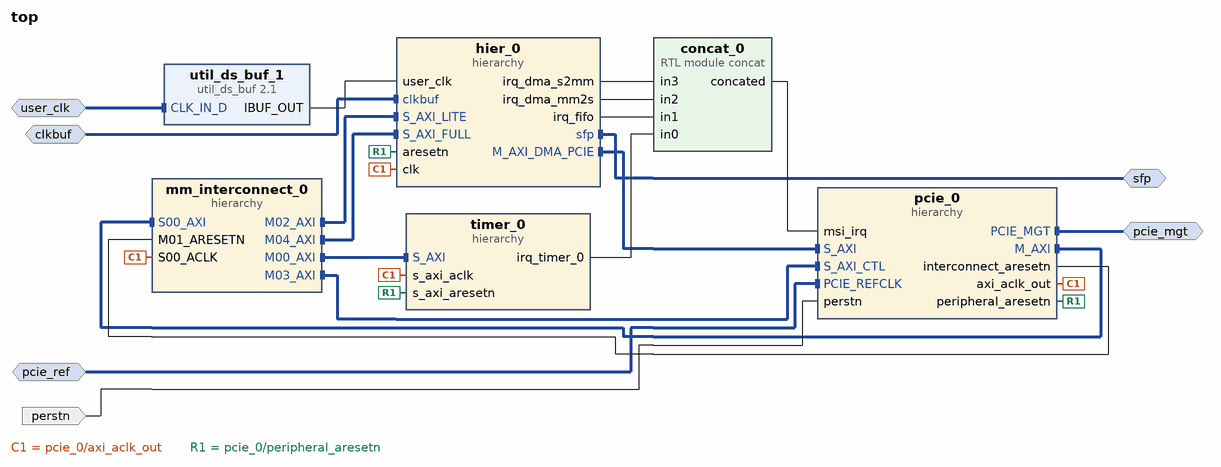
[diagram p0: block diagram of the top level]
# Vivado block design top, xc7vx485tffg1761-2, Vivado 2018.3
create_bd_design top

create_bd_intf_port -mode Slave -vlnv xilinx.com:interface:diff_clock_rtl:1.0 pcie_ref
create_bd_intf_port -mode Master -vlnv xilinx.com:interface:sfp_rtl:1.0 sfp
create_bd_intf_port -mode Slave -vlnv xilinx.com:interface:diff_clock_rtl:1.0 clkbuf
set_property -dict {CONFIG.FREQ_HZ 125000000} [get_bd_intf_ports clkbuf]
create_bd_intf_port -mode Master -vlnv xilinx.com:interface:pcie_7x_mgt_rtl:1.0 pcie_mgt
create_bd_intf_port -mode Slave -vlnv xilinx.com:interface:diff_clock_rtl:1.0 user_clk
set_property -dict {CONFIG.FREQ_HZ 156000000} [get_bd_intf_ports user_clk]
create_bd_port -dir I -type rst perstn

create_bd_cell -type hier timer_0
create_bd_cell -type hier hier_0
create_bd_cell -type hier mm_interconnect_0
create_bd_cell -type hier pcie_0
create_bd_cell -type module -reference concat concat_0
create_bd_cell -type ip -vlnv xilinx.com:ip:util_ds_buf:2.1 util_ds_buf_1

# ---- hierarchy /timer_0 ----
current_bd_instance /timer_0
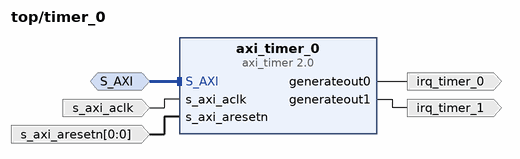
[diagram p1: block diagram inside /timer_0]
create_bd_intf_pin -mode Slave -vlnv xilinx.com:interface:aximm_rtl:1.0 S_AXI
create_bd_pin -dir I -type clk s_axi_aclk
create_bd_pin -dir I -from 0 -to 0 -type rst s_axi_aresetn
create_bd_pin -dir O irq_timer_0
create_bd_pin -dir O irq_timer_1

create_bd_cell -type ip -vlnv xilinx.com:ip:axi_timer:2.0 axi_timer_0

# ---- hierarchy /hier_0 ----
current_bd_instance /hier_0
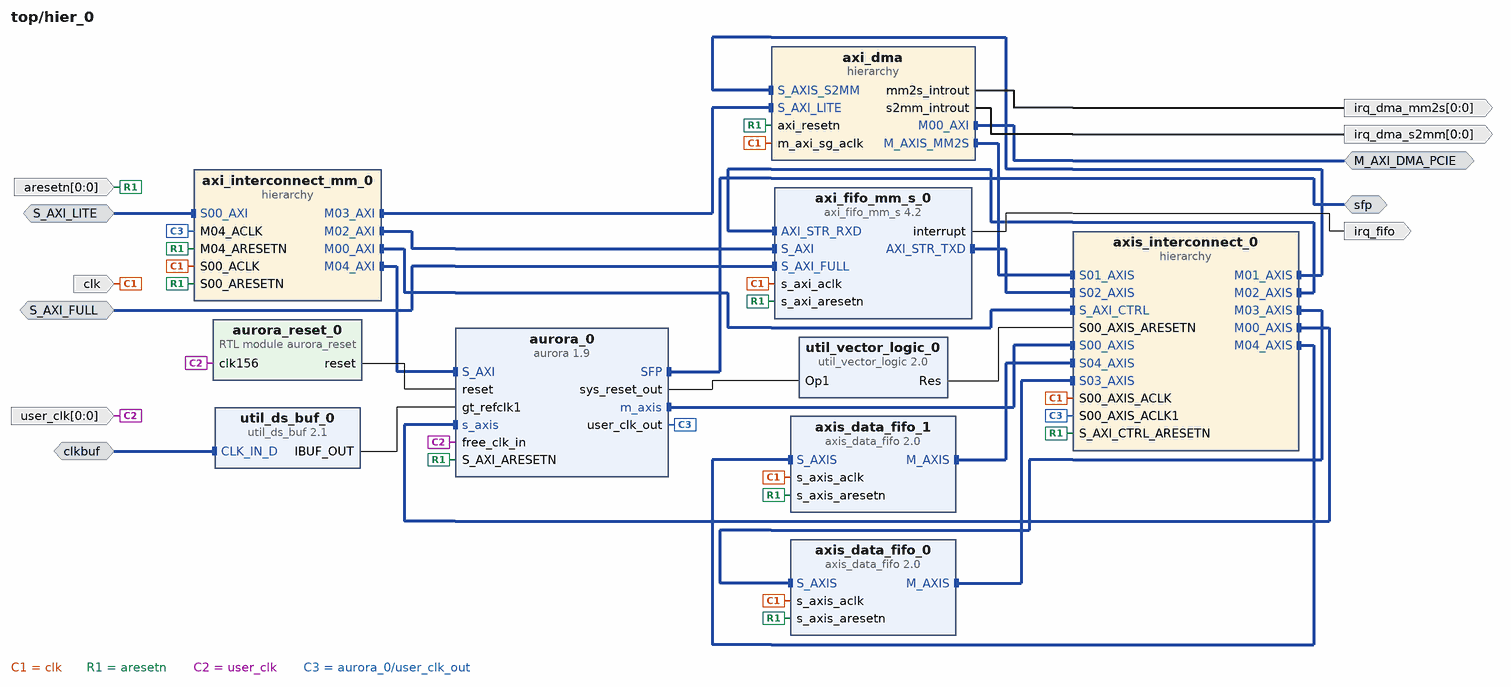
[diagram p2: block diagram inside /hier_0]
create_bd_intf_pin -mode Slave -vlnv xilinx.com:interface:aximm_rtl:1.0 S_AXI_LITE
create_bd_intf_pin -mode Master -vlnv xilinx.com:interface:sfp_rtl:1.0 sfp
create_bd_intf_pin -mode Slave -vlnv xilinx.com:interface:diff_clock_rtl:1.0 clkbuf
create_bd_intf_pin -mode Master -vlnv xilinx.com:interface:aximm_rtl:1.0 M_AXI_DMA_PCIE
create_bd_intf_pin -mode Slave -vlnv xilinx.com:interface:aximm_rtl:1.0 S_AXI_FULL
create_bd_pin -dir O -type intr irq_fifo
create_bd_pin -dir I -type clk clk
create_bd_pin -dir I -from 0 -to 0 -type rst aresetn
create_bd_pin -dir O -from 0 -to 0 -type intr irq_dma_mm2s
create_bd_pin -dir O -from 0 -to 0 -type intr irq_dma_s2mm
create_bd_pin -dir I -from 0 -to 0 user_clk

create_bd_cell -type hier axis_interconnect_0
create_bd_cell -type hier axi_interconnect_mm_0
create_bd_cell -type hier axi_dma
create_bd_cell -type module -reference aurora_reset aurora_reset_0
create_bd_cell -type ip -vlnv xilinx.com:ip:axi_fifo_mm_s:4.2 axi_fifo_mm_s_0
set_property -dict [list \
  CONFIG.C_AXIS_TUSER_WIDTH 4 \
  CONFIG.C_DATA_INTERFACE_TYPE 1 \
  CONFIG.C_RX_FIFO_DEPTH 4096 \
  CONFIG.C_RX_FIFO_PF_THRESHOLD 4090 \
  CONFIG.C_S_AXI4_DATA_WIDTH 32 \
  CONFIG.C_TX_FIFO_DEPTH 4096 \
  CONFIG.C_TX_FIFO_PF_THRESHOLD 4090 \
  CONFIG.C_USE_RX_CUT_THROUGH true \
  CONFIG.C_USE_TX_CTRL 0 \
  CONFIG.C_USE_TX_CUT_THROUGH 1 \
] [get_bd_cells axi_fifo_mm_s_0]
create_bd_cell -type ip -vlnv xilinx.com:ip:axis_data_fifo:2.0 axis_data_fifo_0
set_property -dict {CONFIG.FIFO_DEPTH 1024 CONFIG.HAS_RD_DATA_COUNT 1 CONFIG.HAS_WR_DATA_COUNT 1} [get_bd_cells axis_data_fifo_0]
create_bd_cell -type ip -vlnv xilinx.com:ip:axis_data_fifo:2.0 axis_data_fifo_1
set_property -dict {CONFIG.FIFO_DEPTH 1024 CONFIG.HAS_RD_DATA_COUNT 1 CONFIG.HAS_WR_DATA_COUNT 1} [get_bd_cells axis_data_fifo_1]
create_bd_cell -type ip -vlnv xilinx.com:ip:util_vector_logic:2.0 util_vector_logic_0
set_property -dict {CONFIG.C_OPERATION not CONFIG.C_SIZE 1} [get_bd_cells util_vector_logic_0]
create_bd_cell -type ip -vlnv xilinx.com:ip:util_ds_buf:2.1 util_ds_buf_0
set_property -dict [list \
  CONFIG.C_BUF_TYPE IBUFDSGTE \
  CONFIG.C_SIZE 1 \
  CONFIG.DIFF_CLK_IN_BOARD_INTERFACE Custom \
] [get_bd_cells util_ds_buf_0]
create_bd_cell -type ip -vlnv acs.eonerc.rwth-aachen.de:user:aurora:1.9 aurora_0

# ---- hierarchy /hier_0/axis_interconnect_0 ----
current_bd_instance /hier_0/axis_interconnect_0
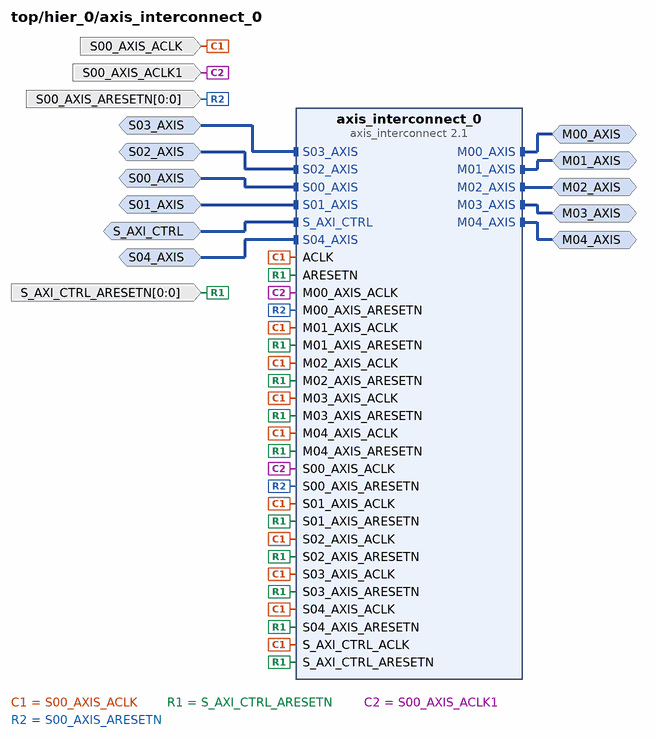
[diagram p3: block diagram inside /hier_0/axis_interconnect_0]
create_bd_intf_pin -mode Slave -vlnv xilinx.com:interface:axis_rtl:1.0 S00_AXIS
create_bd_intf_pin -mode Master -vlnv xilinx.com:interface:axis_rtl:1.0 M00_AXIS
create_bd_intf_pin -mode Master -vlnv xilinx.com:interface:axis_rtl:1.0 M01_AXIS
create_bd_intf_pin -mode Slave -vlnv xilinx.com:interface:axis_rtl:1.0 S01_AXIS
create_bd_intf_pin -mode Slave -vlnv xilinx.com:interface:axis_rtl:1.0 S02_AXIS
create_bd_intf_pin -mode Master -vlnv xilinx.com:interface:axis_rtl:1.0 M02_AXIS
create_bd_intf_pin -mode Slave -vlnv xilinx.com:interface:aximm_rtl:1.0 S_AXI_CTRL
create_bd_intf_pin -mode Master -vlnv xilinx.com:interface:axis_rtl:1.0 M03_AXIS
create_bd_intf_pin -mode Slave -vlnv xilinx.com:interface:axis_rtl:1.0 S03_AXIS
create_bd_intf_pin -mode Master -vlnv xilinx.com:interface:axis_rtl:1.0 M04_AXIS
create_bd_intf_pin -mode Slave -vlnv xilinx.com:interface:axis_rtl:1.0 S04_AXIS
create_bd_pin -dir I -type clk S00_AXIS_ACLK
create_bd_pin -dir I -from 0 -to 0 -type rst S_AXI_CTRL_ARESETN
create_bd_pin -dir I -type clk S00_AXIS_ACLK1
create_bd_pin -dir I -from 0 -to 0 -type rst S00_AXIS_ARESETN

create_bd_cell -type ip -vlnv xilinx.com:ip:axis_interconnect:2.1 axis_interconnect_0
set_property -dict [list \
  CONFIG.ENABLE_ADVANCED_OPTIONS 1 \
  CONFIG.NUM_MI 5 \
  CONFIG.NUM_SI 5 \
  CONFIG.ROUTING_MODE 1 \
] [get_bd_cells axis_interconnect_0]

# ---- hierarchy /hier_0/axi_interconnect_mm_0 ----
current_bd_instance /hier_0/axi_interconnect_mm_0
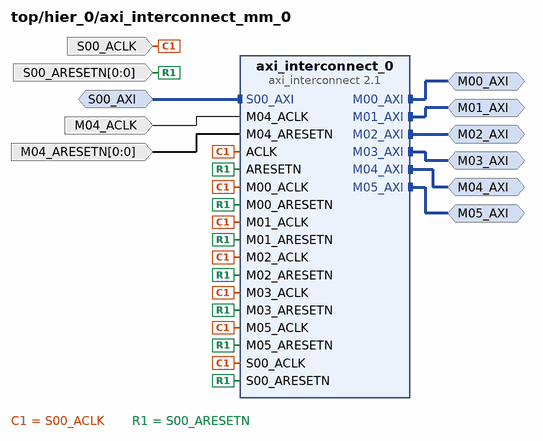
[diagram p4: block diagram inside /hier_0/axi_interconnect_mm_0]
create_bd_intf_pin -mode Slave -vlnv xilinx.com:interface:aximm_rtl:1.0 S00_AXI
create_bd_intf_pin -mode Master -vlnv xilinx.com:interface:aximm_rtl:1.0 M00_AXI
create_bd_intf_pin -mode Master -vlnv xilinx.com:interface:aximm_rtl:1.0 M01_AXI
create_bd_intf_pin -mode Master -vlnv xilinx.com:interface:aximm_rtl:1.0 M02_AXI
create_bd_intf_pin -mode Master -vlnv xilinx.com:interface:aximm_rtl:1.0 M03_AXI
create_bd_intf_pin -mode Master -vlnv xilinx.com:interface:aximm_rtl:1.0 M04_AXI
create_bd_intf_pin -mode Master -vlnv xilinx.com:interface:aximm_rtl:1.0 M05_AXI
create_bd_pin -dir I -type clk S00_ACLK
create_bd_pin -dir I -from 0 -to 0 -type rst S00_ARESETN
create_bd_pin -dir I -type clk M04_ACLK
create_bd_pin -dir I -from 0 -to 0 -type rst M04_ARESETN

create_bd_cell -type ip -vlnv xilinx.com:ip:axi_interconnect:2.1 axi_interconnect_0
set_property -dict {CONFIG.NUM_MI 6 CONFIG.SYNCHRONIZATION_STAGES 2} [get_bd_cells axi_interconnect_0]

# ---- hierarchy /hier_0/axi_dma ----
current_bd_instance /hier_0/axi_dma
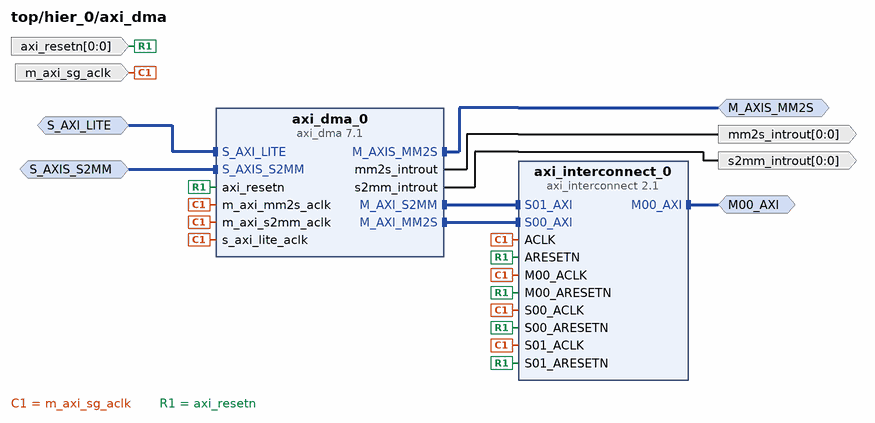
[diagram p5: block diagram inside /hier_0/axi_dma]
create_bd_intf_pin -mode Slave -vlnv xilinx.com:interface:aximm_rtl:1.0 S_AXI_LITE
create_bd_intf_pin -mode Master -vlnv xilinx.com:interface:axis_rtl:1.0 M_AXIS_MM2S
create_bd_intf_pin -mode Slave -vlnv xilinx.com:interface:axis_rtl:1.0 S_AXIS_S2MM
create_bd_intf_pin -mode Master -vlnv xilinx.com:interface:aximm_rtl:1.0 M00_AXI
create_bd_pin -dir I -type clk m_axi_sg_aclk
create_bd_pin -dir I -from 0 -to 0 -type rst axi_resetn
create_bd_pin -dir O -from 0 -to 0 -type intr mm2s_introut
create_bd_pin -dir O -from 0 -to 0 -type intr s2mm_introut

create_bd_cell -type ip -vlnv xilinx.com:ip:axi_dma:7.1 axi_dma_0
set_property -dict [list \
  CONFIG.c_include_mm2s_dre 1 \
  CONFIG.c_include_s2mm_dre 1 \
  CONFIG.c_include_sg 0 \
  CONFIG.c_m_axi_mm2s_data_width 128 \
  CONFIG.c_m_axi_s2mm_data_width 128 \
  CONFIG.c_mm2s_burst_size 64 \
  CONFIG.c_s2mm_burst_size 64 \
] [get_bd_cells axi_dma_0]
create_bd_cell -type ip -vlnv xilinx.com:ip:axi_interconnect:2.1 axi_interconnect_0
set_property -dict {CONFIG.NUM_MI 1 CONFIG.NUM_SI 2 CONFIG.SYNCHRONIZATION_STAGES 2} [get_bd_cells axi_interconnect_0]

# ---- hierarchy /mm_interconnect_0 ----
current_bd_instance /mm_interconnect_0
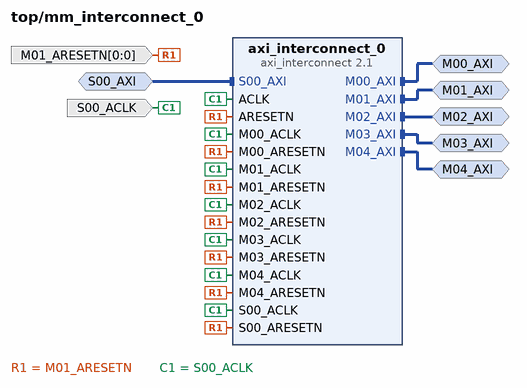
[diagram p6: block diagram inside /mm_interconnect_0]
create_bd_intf_pin -mode Master -vlnv xilinx.com:interface:aximm_rtl:1.0 M00_AXI
create_bd_intf_pin -mode Master -vlnv xilinx.com:interface:aximm_rtl:1.0 M01_AXI
create_bd_intf_pin -mode Master -vlnv xilinx.com:interface:aximm_rtl:1.0 M02_AXI
create_bd_intf_pin -mode Slave -vlnv xilinx.com:interface:aximm_rtl:1.0 S00_AXI
create_bd_intf_pin -mode Master -vlnv xilinx.com:interface:aximm_rtl:1.0 M03_AXI
create_bd_intf_pin -mode Master -vlnv xilinx.com:interface:aximm_rtl:1.0 M04_AXI
create_bd_pin -dir I -type clk S00_ACLK
create_bd_pin -dir I -from 0 -to 0 -type rst M01_ARESETN

create_bd_cell -type ip -vlnv xilinx.com:ip:axi_interconnect:2.1 axi_interconnect_0
set_property -dict [list \
  CONFIG.ENABLE_ADVANCED_OPTIONS 1 \
  CONFIG.NUM_MI 5 \
  CONFIG.NUM_SI 1 \
  CONFIG.SYNCHRONIZATION_STAGES 2 \
] [get_bd_cells axi_interconnect_0]

# ---- hierarchy /pcie_0 ----
current_bd_instance /pcie_0
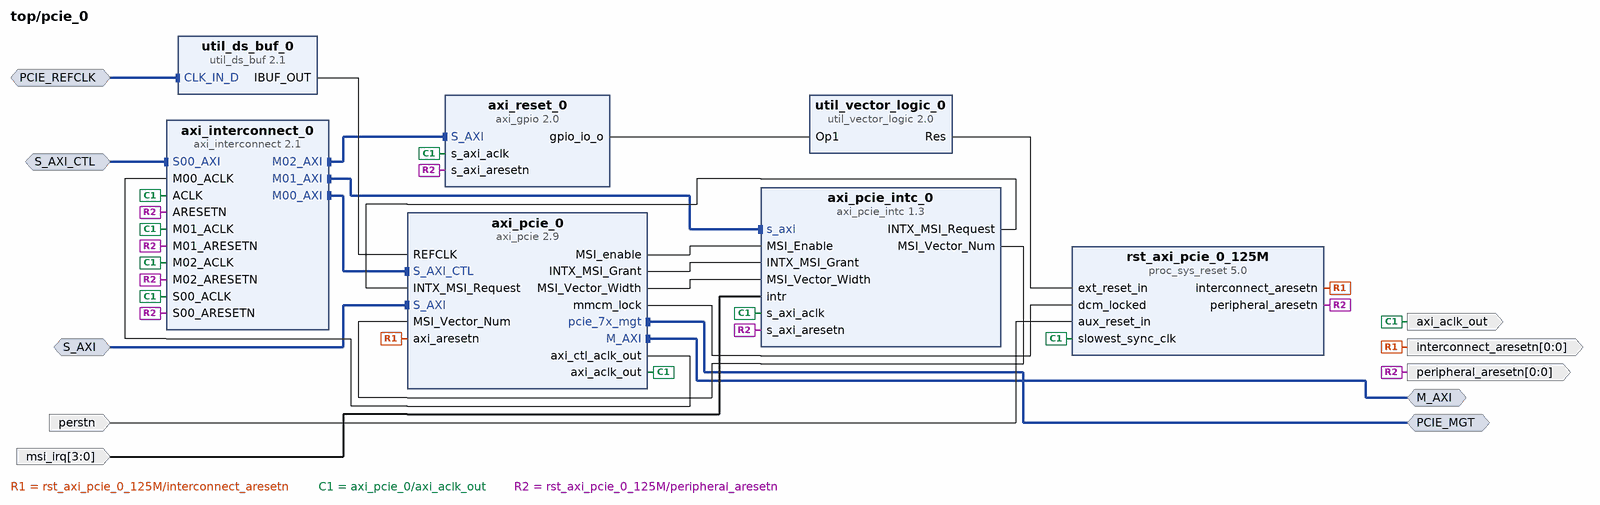
[diagram p7: block diagram inside /pcie_0]
create_bd_intf_pin -mode Master -vlnv xilinx.com:interface:aximm_rtl:1.0 M_AXI
create_bd_intf_pin -mode Master -vlnv xilinx.com:interface:pcie_7x_mgt_rtl:1.0 PCIE_MGT
create_bd_intf_pin -mode Slave -vlnv xilinx.com:interface:diff_clock_rtl:1.0 PCIE_REFCLK
create_bd_intf_pin -mode Slave -vlnv xilinx.com:interface:aximm_rtl:1.0 S_AXI
create_bd_intf_pin -mode Slave -vlnv xilinx.com:interface:aximm_rtl:1.0 S_AXI_CTL
create_bd_pin -dir O -type clk axi_aclk_out
create_bd_pin -dir O -from 0 -to 0 -type rst interconnect_aresetn
create_bd_pin -dir I -from 3 -to 0 msi_irq
create_bd_pin -dir O -from 0 -to 0 -type rst peripheral_aresetn
create_bd_pin -dir I -type rst perstn

create_bd_cell -type ip -vlnv xilinx.com:ip:axi_interconnect:2.1 axi_interconnect_0
set_property -dict {CONFIG.NUM_MI 3 CONFIG.SYNCHRONIZATION_STAGES 2} [get_bd_cells axi_interconnect_0]
create_bd_cell -type ip -vlnv xilinx.com:ip:axi_pcie:2.9 axi_pcie_0
set_property -dict [list \
  CONFIG.AXIBAR2PCIEBAR_0 0x00000000 \
  CONFIG.AXIBAR_AS_0 false \
  CONFIG.AXIBAR_NUM 1 \
  CONFIG.BAR0_SCALE Megabytes \
  CONFIG.BAR0_SIZE 4 \
  CONFIG.BAR1_ENABLED false \
  CONFIG.BAR1_SCALE N/A \
  CONFIG.BAR1_SIZE 8 \
  CONFIG.BAR1_TYPE N/A \
  CONFIG.BASE_CLASS_MENU Memory_controller \
  CONFIG.CLASS_CODE 0x050000 \
  CONFIG.COMP_TIMEOUT 50ms \
  CONFIG.DEVICE_ID 0x7022 \
  CONFIG.ENABLE_CLASS_CODE false \
  CONFIG.HIGHADDR 0x10000FFF \
  CONFIG.INTERRUPT_PIN false \
  CONFIG.MAX_LINK_SPEED 5.0_GT/s \
  CONFIG.M_AXI_DATA_WIDTH 128 \
  CONFIG.NO_OF_LANES X4 \
  CONFIG.NUM_MSI_REQ 4 \
  CONFIG.PCIEBAR2AXIBAR_1 0xFFFFFFFF \
  CONFIG.PCIE_BLK_LOCN X1Y0 \
  CONFIG.SUB_CLASS_INTERFACE_MENU RAM \
  CONFIG.S_AXI_DATA_WIDTH 128 \
  CONFIG.S_AXI_SUPPORTS_NARROW_BURST true \
  CONFIG.XLNX_REF_BOARD VC707 \
  CONFIG.en_transceiver_status_ports false \
] [get_bd_cells axi_pcie_0]
create_bd_cell -type ip -vlnv xilinx.com:ip:util_vector_logic:2.0 util_vector_logic_0
set_property -dict {CONFIG.C_OPERATION not CONFIG.C_SIZE 1} [get_bd_cells util_vector_logic_0]
create_bd_cell -type ip -vlnv xilinx.com:ip:axi_gpio:2.0 axi_reset_0
set_property -dict [list \
  CONFIG.C_ALL_OUTPUTS 1 \
  CONFIG.C_DOUT_DEFAULT 0x00000000 \
  CONFIG.C_GPIO_WIDTH 1 \
  CONFIG.C_INTERRUPT_PRESENT 0 \
] [get_bd_cells axi_reset_0]
create_bd_cell -type ip -vlnv xilinx.com:ip:proc_sys_reset:5.0 rst_axi_pcie_0_125M
set_property -dict [list \
  CONFIG.C_AUX_RESET_HIGH 0 \
  CONFIG.C_AUX_RST_WIDTH 1 \
  CONFIG.C_EXT_RST_WIDTH 8 \
  CONFIG.RESET_BOARD_INTERFACE Custom \
  CONFIG.USE_BOARD_FLOW true \
] [get_bd_cells rst_axi_pcie_0_125M]
create_bd_cell -type ip -vlnv xilinx.com:ip:util_ds_buf:2.1 util_ds_buf_0
set_property -dict {CONFIG.C_BUF_TYPE IBUFDSGTE} [get_bd_cells util_ds_buf_0]
create_bd_cell -type ip -vlnv acs.eonerc.rwth-aachen.de:user:axi_pcie_intc:1.3 axi_pcie_intc_0

# ---- connections ----

current_bd_instance /timer_0
connect_bd_intf_net [get_bd_intf_pins S_AXI] [get_bd_intf_pins axi_timer_0/S_AXI]
connect_bd_net -net axi_pcie_0_axi_aclk_out1 [get_bd_pins s_axi_aclk] [get_bd_pins axi_timer_0/s_axi_aclk]
connect_bd_net -net rst_axi_pcie_0_125M_peripheral_aresetn [get_bd_pins s_axi_aresetn] [get_bd_pins axi_timer_0/s_axi_aresetn]
connect_bd_net [get_bd_pins axi_timer_0/generateout1] [get_bd_pins irq_timer_1]
connect_bd_net [get_bd_pins axi_timer_0/generateout0] [get_bd_pins irq_timer_0]

current_bd_instance /hier_0
connect_bd_intf_net [get_bd_intf_pins sfp] [get_bd_intf_pins aurora_0/SFP]
connect_bd_intf_net [get_bd_intf_pins axis_interconnect_0/S_AXI_CTRL] [get_bd_intf_pins axi_interconnect_mm_0/M00_AXI]
connect_bd_intf_net [get_bd_intf_pins axi_interconnect_mm_0/M02_AXI] [get_bd_intf_pins axi_fifo_mm_s_0/S_AXI]
connect_bd_intf_net [get_bd_intf_pins axis_interconnect_0/S01_AXIS] [get_bd_intf_pins axi_dma/M_AXIS_MM2S]
connect_bd_intf_net [get_bd_intf_pins axis_interconnect_0/M04_AXIS] [get_bd_intf_pins axis_data_fifo_1/S_AXIS]
connect_bd_intf_net [get_bd_intf_pins axis_interconnect_0/M01_AXIS] [get_bd_intf_pins axi_dma/S_AXIS_S2MM]
connect_bd_intf_net [get_bd_intf_pins axis_data_fifo_0/M_AXIS] [get_bd_intf_pins axis_interconnect_0/S03_AXIS]
connect_bd_intf_net [get_bd_intf_pins aurora_0/S_AXI] [get_bd_intf_pins axi_interconnect_mm_0/M04_AXI]
connect_bd_intf_net [get_bd_intf_pins axis_data_fifo_1/M_AXIS] [get_bd_intf_pins axis_interconnect_0/S04_AXIS]
connect_bd_intf_net [get_bd_intf_pins axis_interconnect_0/M02_AXIS] [get_bd_intf_pins axi_fifo_mm_s_0/AXI_STR_RXD]
connect_bd_intf_net [get_bd_intf_pins axis_data_fifo_0/S_AXIS] [get_bd_intf_pins axis_interconnect_0/M03_AXIS]
connect_bd_intf_net [get_bd_intf_pins aurora_0/m_axis] [get_bd_intf_pins axis_interconnect_0/S00_AXIS]
connect_bd_intf_net [get_bd_intf_pins S_AXI_LITE] [get_bd_intf_pins axi_interconnect_mm_0/S00_AXI]
connect_bd_intf_net [get_bd_intf_pins axis_interconnect_0/S02_AXIS] [get_bd_intf_pins axi_fifo_mm_s_0/AXI_STR_TXD]
connect_bd_intf_net [get_bd_intf_pins clkbuf] [get_bd_intf_pins util_ds_buf_0/CLK_IN_D]
connect_bd_intf_net [get_bd_intf_pins aurora_0/s_axis] [get_bd_intf_pins axis_interconnect_0/M00_AXIS]
connect_bd_intf_net [get_bd_intf_pins S_AXI_FULL] [get_bd_intf_pins axi_fifo_mm_s_0/S_AXI_FULL]
connect_bd_intf_net [get_bd_intf_pins axi_dma/S_AXI_LITE] [get_bd_intf_pins axi_interconnect_mm_0/M03_AXI]
connect_bd_intf_net [get_bd_intf_pins M_AXI_DMA_PCIE] [get_bd_intf_pins axi_dma/M00_AXI]
connect_bd_net -net xsg_pio_interrupt [get_bd_pins axi_fifo_mm_s_0/interrupt] [get_bd_pins irq_fifo]
connect_bd_net -net s_axi_aclk_1 [get_bd_pins clk] \
  [get_bd_pins axis_interconnect_0/S00_AXIS_ACLK] [get_bd_pins axi_interconnect_mm_0/S00_ACLK] \
  [get_bd_pins axi_dma/m_axi_sg_aclk] [get_bd_pins axi_fifo_mm_s_0/s_axi_aclk] [get_bd_pins axis_data_fifo_0/s_axis_aclk] \
  [get_bd_pins axis_data_fifo_1/s_axis_aclk]
connect_bd_net -net axi_dma_0_mm2s_introut [get_bd_pins axi_dma/mm2s_introut] [get_bd_pins irq_dma_mm2s]
connect_bd_net -net axi_dma_0_s2mm_introut [get_bd_pins axi_dma/s2mm_introut] [get_bd_pins irq_dma_s2mm]
connect_bd_net -net pcie_0_peripheral_aresetn [get_bd_pins aresetn] \
  [get_bd_pins axis_interconnect_0/S_AXI_CTRL_ARESETN] [get_bd_pins axi_interconnect_mm_0/S00_ARESETN] \
  [get_bd_pins axi_dma/axi_resetn] [get_bd_pins axi_interconnect_mm_0/M04_ARESETN] \
  [get_bd_pins axi_fifo_mm_s_0/s_axi_aresetn] [get_bd_pins axis_data_fifo_0/s_axis_aresetn] \
  [get_bd_pins axis_data_fifo_1/s_axis_aresetn] [get_bd_pins aurora_0/S_AXI_ARESETN]
connect_bd_net [get_bd_pins aurora_0/sys_reset_out] [get_bd_pins util_vector_logic_0/Op1]
connect_bd_net [get_bd_pins util_ds_buf_0/IBUF_OUT] [get_bd_pins aurora_0/gt_refclk1]
connect_bd_net [get_bd_pins user_clk] [get_bd_pins aurora_reset_0/clk156] [get_bd_pins aurora_0/free_clk_in]
connect_bd_net -net S00_AXIS_ACLK1_1 [get_bd_pins aurora_0/user_clk_out] \
  [get_bd_pins axis_interconnect_0/S00_AXIS_ACLK1] [get_bd_pins axi_interconnect_mm_0/M04_ACLK]
connect_bd_net -net S00_AXIS_ARESETN_1 [get_bd_pins util_vector_logic_0/Res] [get_bd_pins axis_interconnect_0/S00_AXIS_ARESETN]
connect_bd_net [get_bd_pins aurora_reset_0/reset] [get_bd_pins aurora_0/reset]

current_bd_instance /hier_0/axis_interconnect_0
connect_bd_intf_net [get_bd_intf_pins M04_AXIS] [get_bd_intf_pins axis_interconnect_0/M04_AXIS]
connect_bd_intf_net [get_bd_intf_pins S03_AXIS] [get_bd_intf_pins axis_interconnect_0/S03_AXIS]
connect_bd_intf_net [get_bd_intf_pins S02_AXIS] [get_bd_intf_pins axis_interconnect_0/S02_AXIS]
connect_bd_intf_net [get_bd_intf_pins M03_AXIS] [get_bd_intf_pins axis_interconnect_0/M03_AXIS]
connect_bd_intf_net [get_bd_intf_pins S00_AXIS] [get_bd_intf_pins axis_interconnect_0/S00_AXIS]
connect_bd_intf_net [get_bd_intf_pins M02_AXIS] [get_bd_intf_pins axis_interconnect_0/M02_AXIS]
connect_bd_intf_net [get_bd_intf_pins S01_AXIS] [get_bd_intf_pins axis_interconnect_0/S01_AXIS]
connect_bd_intf_net [get_bd_intf_pins S_AXI_CTRL] [get_bd_intf_pins axis_interconnect_0/S_AXI_CTRL]
connect_bd_intf_net [get_bd_intf_pins M01_AXIS] [get_bd_intf_pins axis_interconnect_0/M01_AXIS]
connect_bd_intf_net [get_bd_intf_pins M00_AXIS] [get_bd_intf_pins axis_interconnect_0/M00_AXIS]
connect_bd_intf_net [get_bd_intf_pins S04_AXIS] [get_bd_intf_pins axis_interconnect_0/S04_AXIS]
connect_bd_net -net s_axi_aclk_2 [get_bd_pins S00_AXIS_ACLK] \
  [get_bd_pins axis_interconnect_0/ACLK] [get_bd_pins axis_interconnect_0/S01_AXIS_ACLK] \
  [get_bd_pins axis_interconnect_0/S02_AXIS_ACLK] [get_bd_pins axis_interconnect_0/S03_AXIS_ACLK] \
  [get_bd_pins axis_interconnect_0/S04_AXIS_ACLK] [get_bd_pins axis_interconnect_0/M01_AXIS_ACLK] \
  [get_bd_pins axis_interconnect_0/M02_AXIS_ACLK] [get_bd_pins axis_interconnect_0/M03_AXIS_ACLK] \
  [get_bd_pins axis_interconnect_0/M04_AXIS_ACLK] [get_bd_pins axis_interconnect_0/S_AXI_CTRL_ACLK]
connect_bd_net -net s_axi_aresetn_1 [get_bd_pins S_AXI_CTRL_ARESETN] \
  [get_bd_pins axis_interconnect_0/ARESETN] [get_bd_pins axis_interconnect_0/S01_AXIS_ARESETN] \
  [get_bd_pins axis_interconnect_0/S02_AXIS_ARESETN] [get_bd_pins axis_interconnect_0/S03_AXIS_ARESETN] \
  [get_bd_pins axis_interconnect_0/S04_AXIS_ARESETN] [get_bd_pins axis_interconnect_0/M01_AXIS_ARESETN] \
  [get_bd_pins axis_interconnect_0/M02_AXIS_ARESETN] [get_bd_pins axis_interconnect_0/M03_AXIS_ARESETN] \
  [get_bd_pins axis_interconnect_0/M04_AXIS_ARESETN] [get_bd_pins axis_interconnect_0/S_AXI_CTRL_ARESETN]
connect_bd_net [get_bd_pins S00_AXIS_ACLK1] [get_bd_pins axis_interconnect_0/S00_AXIS_ACLK] [get_bd_pins axis_interconnect_0/M00_AXIS_ACLK]
connect_bd_net [get_bd_pins S00_AXIS_ARESETN] [get_bd_pins axis_interconnect_0/S00_AXIS_ARESETN] [get_bd_pins axis_interconnect_0/M00_AXIS_ARESETN]

current_bd_instance /hier_0/axi_interconnect_mm_0
connect_bd_intf_net [get_bd_intf_pins M03_AXI] [get_bd_intf_pins axi_interconnect_0/M03_AXI]
connect_bd_intf_net [get_bd_intf_pins M00_AXI] [get_bd_intf_pins axi_interconnect_0/M00_AXI]
connect_bd_intf_net [get_bd_intf_pins M01_AXI] [get_bd_intf_pins axi_interconnect_0/M01_AXI]
connect_bd_intf_net [get_bd_intf_pins M05_AXI] [get_bd_intf_pins axi_interconnect_0/M05_AXI]
connect_bd_intf_net [get_bd_intf_pins M04_AXI] [get_bd_intf_pins axi_interconnect_0/M04_AXI]
connect_bd_intf_net [get_bd_intf_pins S00_AXI] [get_bd_intf_pins axi_interconnect_0/S00_AXI]
connect_bd_intf_net [get_bd_intf_pins M02_AXI] [get_bd_intf_pins axi_interconnect_0/M02_AXI]
connect_bd_net -net s_axi_aclk_1 [get_bd_pins S00_ACLK] \
  [get_bd_pins axi_interconnect_0/ACLK] [get_bd_pins axi_interconnect_0/S00_ACLK] [get_bd_pins axi_interconnect_0/M00_ACLK] \
  [get_bd_pins axi_interconnect_0/M01_ACLK] [get_bd_pins axi_interconnect_0/M02_ACLK] \
  [get_bd_pins axi_interconnect_0/M03_ACLK] [get_bd_pins axi_interconnect_0/M05_ACLK]
connect_bd_net -net pcie_0_peripheral_aresetn [get_bd_pins S00_ARESETN] \
  [get_bd_pins axi_interconnect_0/ARESETN] [get_bd_pins axi_interconnect_0/S00_ARESETN] \
  [get_bd_pins axi_interconnect_0/M00_ARESETN] [get_bd_pins axi_interconnect_0/M01_ARESETN] \
  [get_bd_pins axi_interconnect_0/M02_ARESETN] [get_bd_pins axi_interconnect_0/M03_ARESETN] \
  [get_bd_pins axi_interconnect_0/M05_ARESETN]
connect_bd_net [get_bd_pins M04_ACLK] [get_bd_pins axi_interconnect_0/M04_ACLK]
connect_bd_net [get_bd_pins M04_ARESETN] [get_bd_pins axi_interconnect_0/M04_ARESETN]

current_bd_instance /hier_0/axi_dma
connect_bd_intf_net [get_bd_intf_pins axi_dma_0/M_AXI_S2MM] [get_bd_intf_pins axi_interconnect_0/S01_AXI]
connect_bd_intf_net [get_bd_intf_pins M00_AXI] [get_bd_intf_pins axi_interconnect_0/M00_AXI]
connect_bd_intf_net [get_bd_intf_pins S_AXI_LITE] [get_bd_intf_pins axi_dma_0/S_AXI_LITE]
connect_bd_intf_net [get_bd_intf_pins S_AXIS_S2MM] [get_bd_intf_pins axi_dma_0/S_AXIS_S2MM]
connect_bd_intf_net [get_bd_intf_pins M_AXIS_MM2S] [get_bd_intf_pins axi_dma_0/M_AXIS_MM2S]
connect_bd_intf_net [get_bd_intf_pins axi_dma_0/M_AXI_MM2S] [get_bd_intf_pins axi_interconnect_0/S00_AXI]
connect_bd_net -net s_axi_aclk_1 [get_bd_pins m_axi_sg_aclk] \
  [get_bd_pins axi_dma_0/s_axi_lite_aclk] [get_bd_pins axi_dma_0/m_axi_mm2s_aclk] [get_bd_pins axi_dma_0/m_axi_s2mm_aclk] \
  [get_bd_pins axi_interconnect_0/ACLK] [get_bd_pins axi_interconnect_0/S00_ACLK] [get_bd_pins axi_interconnect_0/S01_ACLK] \
  [get_bd_pins axi_interconnect_0/M00_ACLK]
connect_bd_net -net pcie_0_peripheral_aresetn [get_bd_pins axi_resetn] \
  [get_bd_pins axi_dma_0/axi_resetn] [get_bd_pins axi_interconnect_0/ARESETN] [get_bd_pins axi_interconnect_0/S00_ARESETN] \
  [get_bd_pins axi_interconnect_0/S01_ARESETN] [get_bd_pins axi_interconnect_0/M00_ARESETN]
connect_bd_net [get_bd_pins axi_dma_0/s2mm_introut] [get_bd_pins s2mm_introut]
connect_bd_net [get_bd_pins axi_dma_0/mm2s_introut] [get_bd_pins mm2s_introut]

current_bd_instance /mm_interconnect_0
connect_bd_intf_net [get_bd_intf_pins M03_AXI] [get_bd_intf_pins axi_interconnect_0/M03_AXI]
connect_bd_intf_net [get_bd_intf_pins M00_AXI] [get_bd_intf_pins axi_interconnect_0/M00_AXI]
connect_bd_intf_net [get_bd_intf_pins M01_AXI] [get_bd_intf_pins axi_interconnect_0/M01_AXI]
connect_bd_intf_net [get_bd_intf_pins M02_AXI] [get_bd_intf_pins axi_interconnect_0/M02_AXI]
connect_bd_intf_net [get_bd_intf_pins S00_AXI] [get_bd_intf_pins axi_interconnect_0/S00_AXI]
connect_bd_intf_net [get_bd_intf_pins M04_AXI] [get_bd_intf_pins axi_interconnect_0/M04_AXI]
connect_bd_net -net S00_ARESETN_1 [get_bd_pins M01_ARESETN] \
  [get_bd_pins axi_interconnect_0/ARESETN] [get_bd_pins axi_interconnect_0/S00_ARESETN] \
  [get_bd_pins axi_interconnect_0/M00_ARESETN] [get_bd_pins axi_interconnect_0/M01_ARESETN] \
  [get_bd_pins axi_interconnect_0/M02_ARESETN] [get_bd_pins axi_interconnect_0/M03_ARESETN] \
  [get_bd_pins axi_interconnect_0/M04_ARESETN]
connect_bd_net -net axi_pcie_0_axi_aclk_out1 [get_bd_pins S00_ACLK] \
  [get_bd_pins axi_interconnect_0/ACLK] [get_bd_pins axi_interconnect_0/S00_ACLK] [get_bd_pins axi_interconnect_0/M00_ACLK] \
  [get_bd_pins axi_interconnect_0/M01_ACLK] [get_bd_pins axi_interconnect_0/M02_ACLK] \
  [get_bd_pins axi_interconnect_0/M03_ACLK] [get_bd_pins axi_interconnect_0/M04_ACLK]

current_bd_instance /pcie_0
connect_bd_intf_net [get_bd_intf_pins PCIE_MGT] [get_bd_intf_pins axi_pcie_0/pcie_7x_mgt]
connect_bd_intf_net [get_bd_intf_pins axi_interconnect_0/M01_AXI] [get_bd_intf_pins axi_pcie_intc_0/s_axi]
connect_bd_intf_net [get_bd_intf_pins M_AXI] [get_bd_intf_pins axi_pcie_0/M_AXI]
connect_bd_intf_net [get_bd_intf_pins S_AXI] [get_bd_intf_pins axi_pcie_0/S_AXI]
connect_bd_intf_net [get_bd_intf_pins axi_reset_0/S_AXI] [get_bd_intf_pins axi_interconnect_0/M02_AXI]
connect_bd_intf_net [get_bd_intf_pins PCIE_REFCLK] [get_bd_intf_pins util_ds_buf_0/CLK_IN_D]
connect_bd_intf_net [get_bd_intf_pins S_AXI_CTL] [get_bd_intf_pins axi_interconnect_0/S00_AXI]
connect_bd_intf_net [get_bd_intf_pins axi_interconnect_0/M00_AXI] [get_bd_intf_pins axi_pcie_0/S_AXI_CTL]
connect_bd_net -net S00_ARESETN_1 [get_bd_pins rst_axi_pcie_0_125M/interconnect_aresetn] \
  [get_bd_pins interconnect_aresetn] [get_bd_pins axi_pcie_0/axi_aresetn]
connect_bd_net -net aux_reset_in_1 [get_bd_pins perstn] [get_bd_pins rst_axi_pcie_0_125M/aux_reset_in]
connect_bd_net [get_bd_pins axi_pcie_0/axi_aclk_out] \
  [get_bd_pins axi_aclk_out] [get_bd_pins axi_interconnect_0/ACLK] [get_bd_pins axi_interconnect_0/S00_ACLK] \
  [get_bd_pins axi_interconnect_0/M01_ACLK] [get_bd_pins axi_interconnect_0/M02_ACLK] [get_bd_pins axi_reset_0/s_axi_aclk] \
  [get_bd_pins rst_axi_pcie_0_125M/slowest_sync_clk] [get_bd_pins axi_pcie_intc_0/s_axi_aclk]
connect_bd_net [get_bd_pins axi_pcie_0/axi_ctl_aclk_out] [get_bd_pins axi_interconnect_0/M00_ACLK]
connect_bd_net [get_bd_pins axi_pcie_0/mmcm_lock] [get_bd_pins rst_axi_pcie_0_125M/dcm_locked]
connect_bd_net [get_bd_pins util_ds_buf_0/IBUF_OUT] [get_bd_pins axi_pcie_0/REFCLK]
connect_bd_net [get_bd_pins rst_axi_pcie_0_125M/peripheral_aresetn] \
  [get_bd_pins peripheral_aresetn] [get_bd_pins axi_interconnect_0/ARESETN] [get_bd_pins axi_interconnect_0/S00_ARESETN] \
  [get_bd_pins axi_interconnect_0/M01_ARESETN] [get_bd_pins axi_interconnect_0/M02_ARESETN] \
  [get_bd_pins axi_reset_0/s_axi_aresetn] [get_bd_pins axi_pcie_intc_0/s_axi_aresetn]
connect_bd_net [get_bd_pins axi_pcie_intc_0/INTX_MSI_Request] [get_bd_pins axi_pcie_0/INTX_MSI_Request]
connect_bd_net [get_bd_pins axi_pcie_intc_0/MSI_Vector_Num] [get_bd_pins axi_pcie_0/MSI_Vector_Num]
connect_bd_net [get_bd_pins msi_irq] [get_bd_pins axi_pcie_intc_0/intr]
connect_bd_net [get_bd_pins axi_pcie_0/MSI_enable] [get_bd_pins axi_pcie_intc_0/MSI_Enable]
connect_bd_net [get_bd_pins axi_pcie_0/INTX_MSI_Grant] [get_bd_pins axi_pcie_intc_0/INTX_MSI_Grant]
connect_bd_net [get_bd_pins axi_pcie_0/MSI_Vector_Width] [get_bd_pins axi_pcie_intc_0/MSI_Vector_Width]
connect_bd_net [get_bd_pins axi_reset_0/gpio_io_o] [get_bd_pins util_vector_logic_0/Op1]
connect_bd_net [get_bd_pins util_vector_logic_0/Res] [get_bd_pins rst_axi_pcie_0_125M/ext_reset_in]

current_bd_instance /
connect_bd_intf_net [get_bd_intf_ports user_clk] [get_bd_intf_pins util_ds_buf_1/CLK_IN_D]
connect_bd_intf_net [get_bd_intf_ports clkbuf] [get_bd_intf_pins hier_0/clkbuf]
connect_bd_intf_net [get_bd_intf_ports pcie_ref] [get_bd_intf_pins pcie_0/PCIE_REFCLK]
connect_bd_intf_net [get_bd_intf_pins mm_interconnect_0/M03_AXI] [get_bd_intf_pins pcie_0/S_AXI_CTL]
connect_bd_intf_net [get_bd_intf_pins pcie_0/M_AXI] [get_bd_intf_pins mm_interconnect_0/S00_AXI]
connect_bd_intf_net [get_bd_intf_ports pcie_mgt] [get_bd_intf_pins pcie_0/PCIE_MGT]
connect_bd_intf_net [get_bd_intf_pins hier_0/M_AXI_DMA_PCIE] [get_bd_intf_pins pcie_0/S_AXI]
connect_bd_intf_net [get_bd_intf_ports sfp] [get_bd_intf_pins hier_0/sfp]
connect_bd_intf_net [get_bd_intf_pins mm_interconnect_0/M02_AXI] [get_bd_intf_pins hier_0/S_AXI_LITE]
connect_bd_intf_net [get_bd_intf_pins mm_interconnect_0/M04_AXI] [get_bd_intf_pins hier_0/S_AXI_FULL]
connect_bd_intf_net [get_bd_intf_pins mm_interconnect_0/M00_AXI] [get_bd_intf_pins timer_0/S_AXI]
connect_bd_net -net s_axi_aclk_1 [get_bd_pins pcie_0/axi_aclk_out] \
  [get_bd_pins timer_0/s_axi_aclk] [get_bd_pins hier_0/clk] [get_bd_pins mm_interconnect_0/S00_ACLK]
connect_bd_net [get_bd_pins pcie_0/peripheral_aresetn] [get_bd_pins timer_0/s_axi_aresetn] [get_bd_pins hier_0/aresetn]
connect_bd_net [get_bd_pins pcie_0/interconnect_aresetn] [get_bd_pins mm_interconnect_0/M01_ARESETN]
connect_bd_net [get_bd_ports perstn] [get_bd_pins pcie_0/perstn]
connect_bd_net -net user_clk_1 [get_bd_pins util_ds_buf_1/IBUF_OUT] [get_bd_pins hier_0/user_clk]
connect_bd_net [get_bd_pins hier_0/irq_dma_s2mm] [get_bd_pins concat_0/in3]
connect_bd_net [get_bd_pins hier_0/irq_dma_mm2s] [get_bd_pins concat_0/in2]
connect_bd_net [get_bd_pins hier_0/irq_fifo] [get_bd_pins concat_0/in1]
connect_bd_net [get_bd_pins timer_0/irq_timer_0] [get_bd_pins concat_0/in0]
connect_bd_net -net msi_irq_1 [get_bd_pins concat_0/concated] [get_bd_pins pcie_0/msi_irq]

# ---- address map ----
assign_bd_address -offset 0x00000000 -range 4G -target_address_space [get_bd_addr_spaces hier_0/axi_dma/axi_dma_0/Data_MM2S] [get_bd_addr_segs pcie_0/axi_pcie_0/S_AXI/BAR0]
assign_bd_address -offset 0x00000000 -range 4G -target_address_space [get_bd_addr_spaces hier_0/axi_dma/axi_dma_0/Data_S2MM] [get_bd_addr_segs pcie_0/axi_pcie_0/S_AXI/BAR0]
assign_bd_address -offset 0x00001000 -range 4K -target_address_space [get_bd_addr_spaces pcie_0/axi_pcie_0/M_AXI] [get_bd_addr_segs pcie_0/axi_pcie_intc_0/s_axi/reg0]
assign_bd_address -offset 0x00003000 -range 4K -target_address_space [get_bd_addr_spaces pcie_0/axi_pcie_0/M_AXI] [get_bd_addr_segs hier_0/axi_dma/axi_dma_0/S_AXI_LITE/Reg]
assign_bd_address -offset 0x00004000 -range 4K -target_address_space [get_bd_addr_spaces pcie_0/axi_pcie_0/M_AXI] [get_bd_addr_segs timer_0/axi_timer_0/S_AXI/Reg]
assign_bd_address -offset 0x00005000 -range 4K -target_address_space [get_bd_addr_spaces pcie_0/axi_pcie_0/M_AXI] [get_bd_addr_segs hier_0/axis_interconnect_0/axis_interconnect_0/xbar/S_AXI_CTRL/Reg]
assign_bd_address -offset 0x00006000 -range 4K -target_address_space [get_bd_addr_spaces pcie_0/axi_pcie_0/M_AXI] [get_bd_addr_segs hier_0/aurora_0/S_AXI/reg0]
assign_bd_address -offset 0x00007000 -range 4K -target_address_space [get_bd_addr_spaces pcie_0/axi_pcie_0/M_AXI] [get_bd_addr_segs pcie_0/axi_reset_0/S_AXI/Reg]
assign_bd_address -offset 0x00008000 -range 8K -target_address_space [get_bd_addr_spaces pcie_0/axi_pcie_0/M_AXI] [get_bd_addr_segs hier_0/axi_fifo_mm_s_0/S_AXI/Mem0]
assign_bd_address -offset 0x0000C000 -range 8K -target_address_space [get_bd_addr_spaces pcie_0/axi_pcie_0/M_AXI] [get_bd_addr_segs hier_0/axi_fifo_mm_s_0/S_AXI_FULL/Mem1]
assign_bd_address -offset 0x10000000 -range 256M -target_address_space [get_bd_addr_spaces pcie_0/axi_pcie_0/M_AXI] [get_bd_addr_segs pcie_0/axi_pcie_0/S_AXI_CTL/CTL0]

validate_bd_design
save_bd_design
